# EasyEDA schematic SCH_Snoopy_2026-08-06.json

## Sheets
1 Ethernet_IO: TITLE: Ethernet IO; REV: 1.0; Date: 2026-07-02; Sheet: 1/1; Drawn By: httperry; Company: HackClub - Macondo
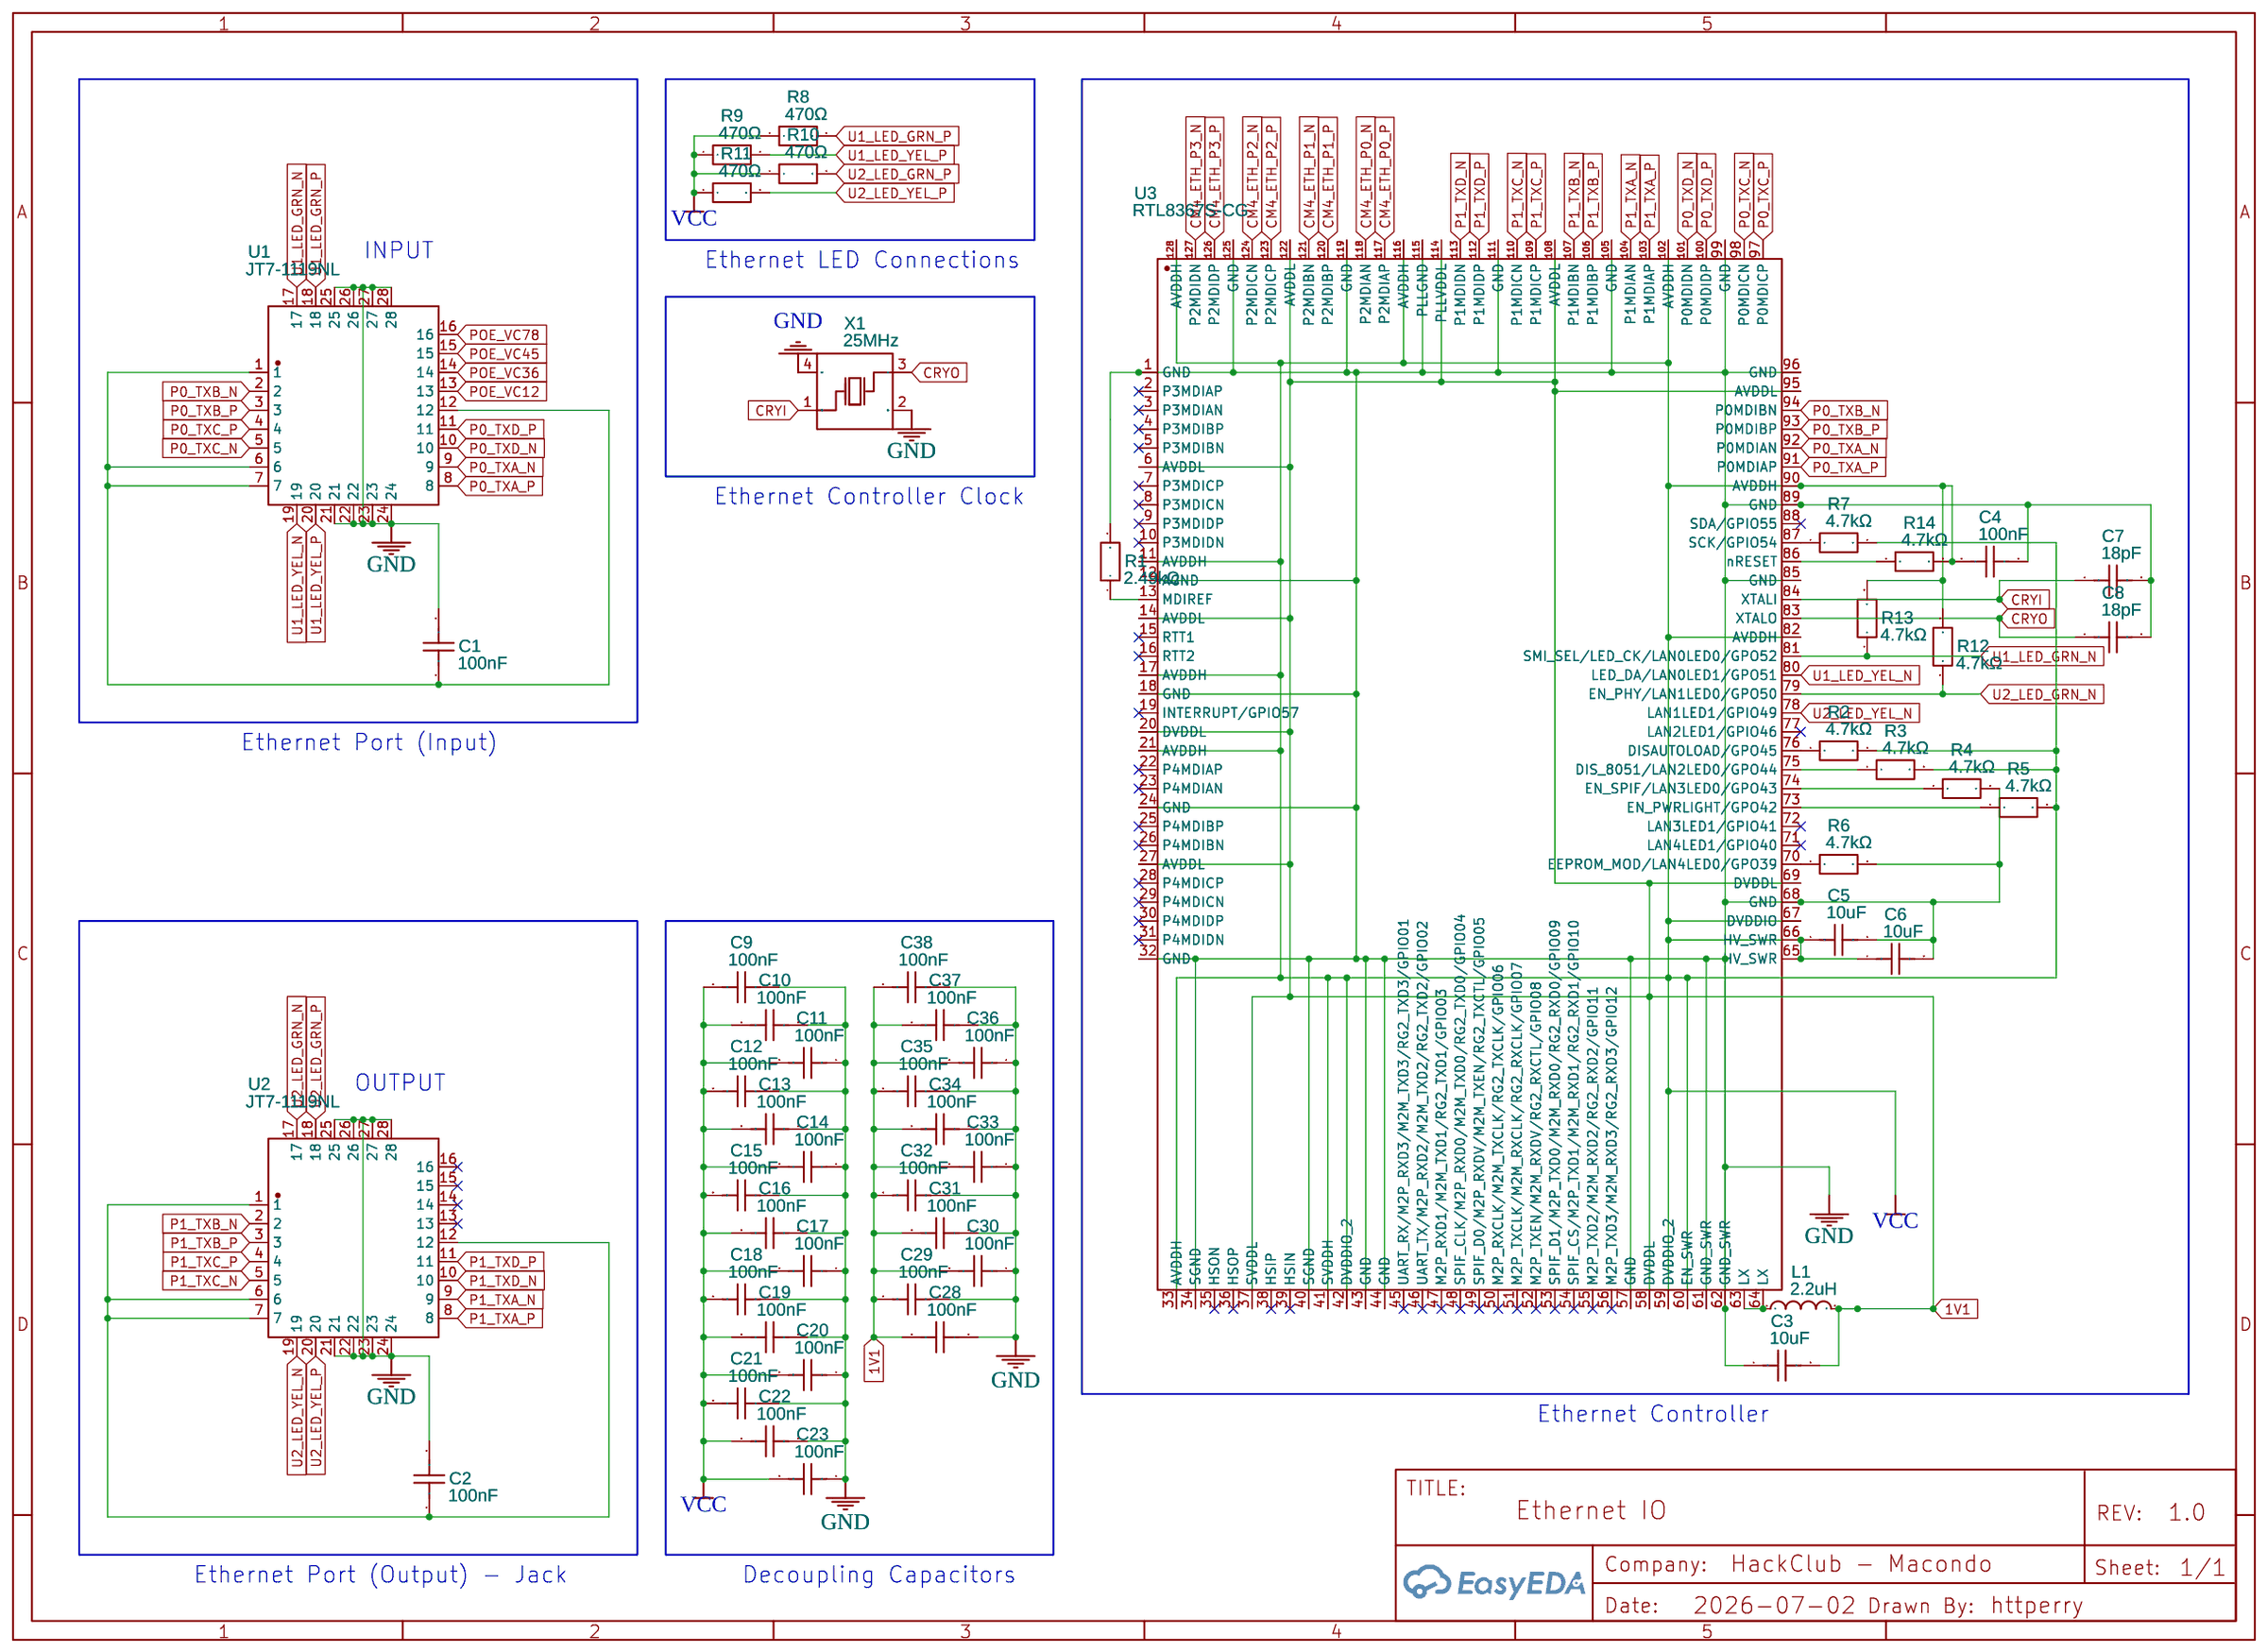
[diagram p0: Ethernet_IO]
2 PWR_Management: TITLE: PWR_Management; Date: 2026-07-03
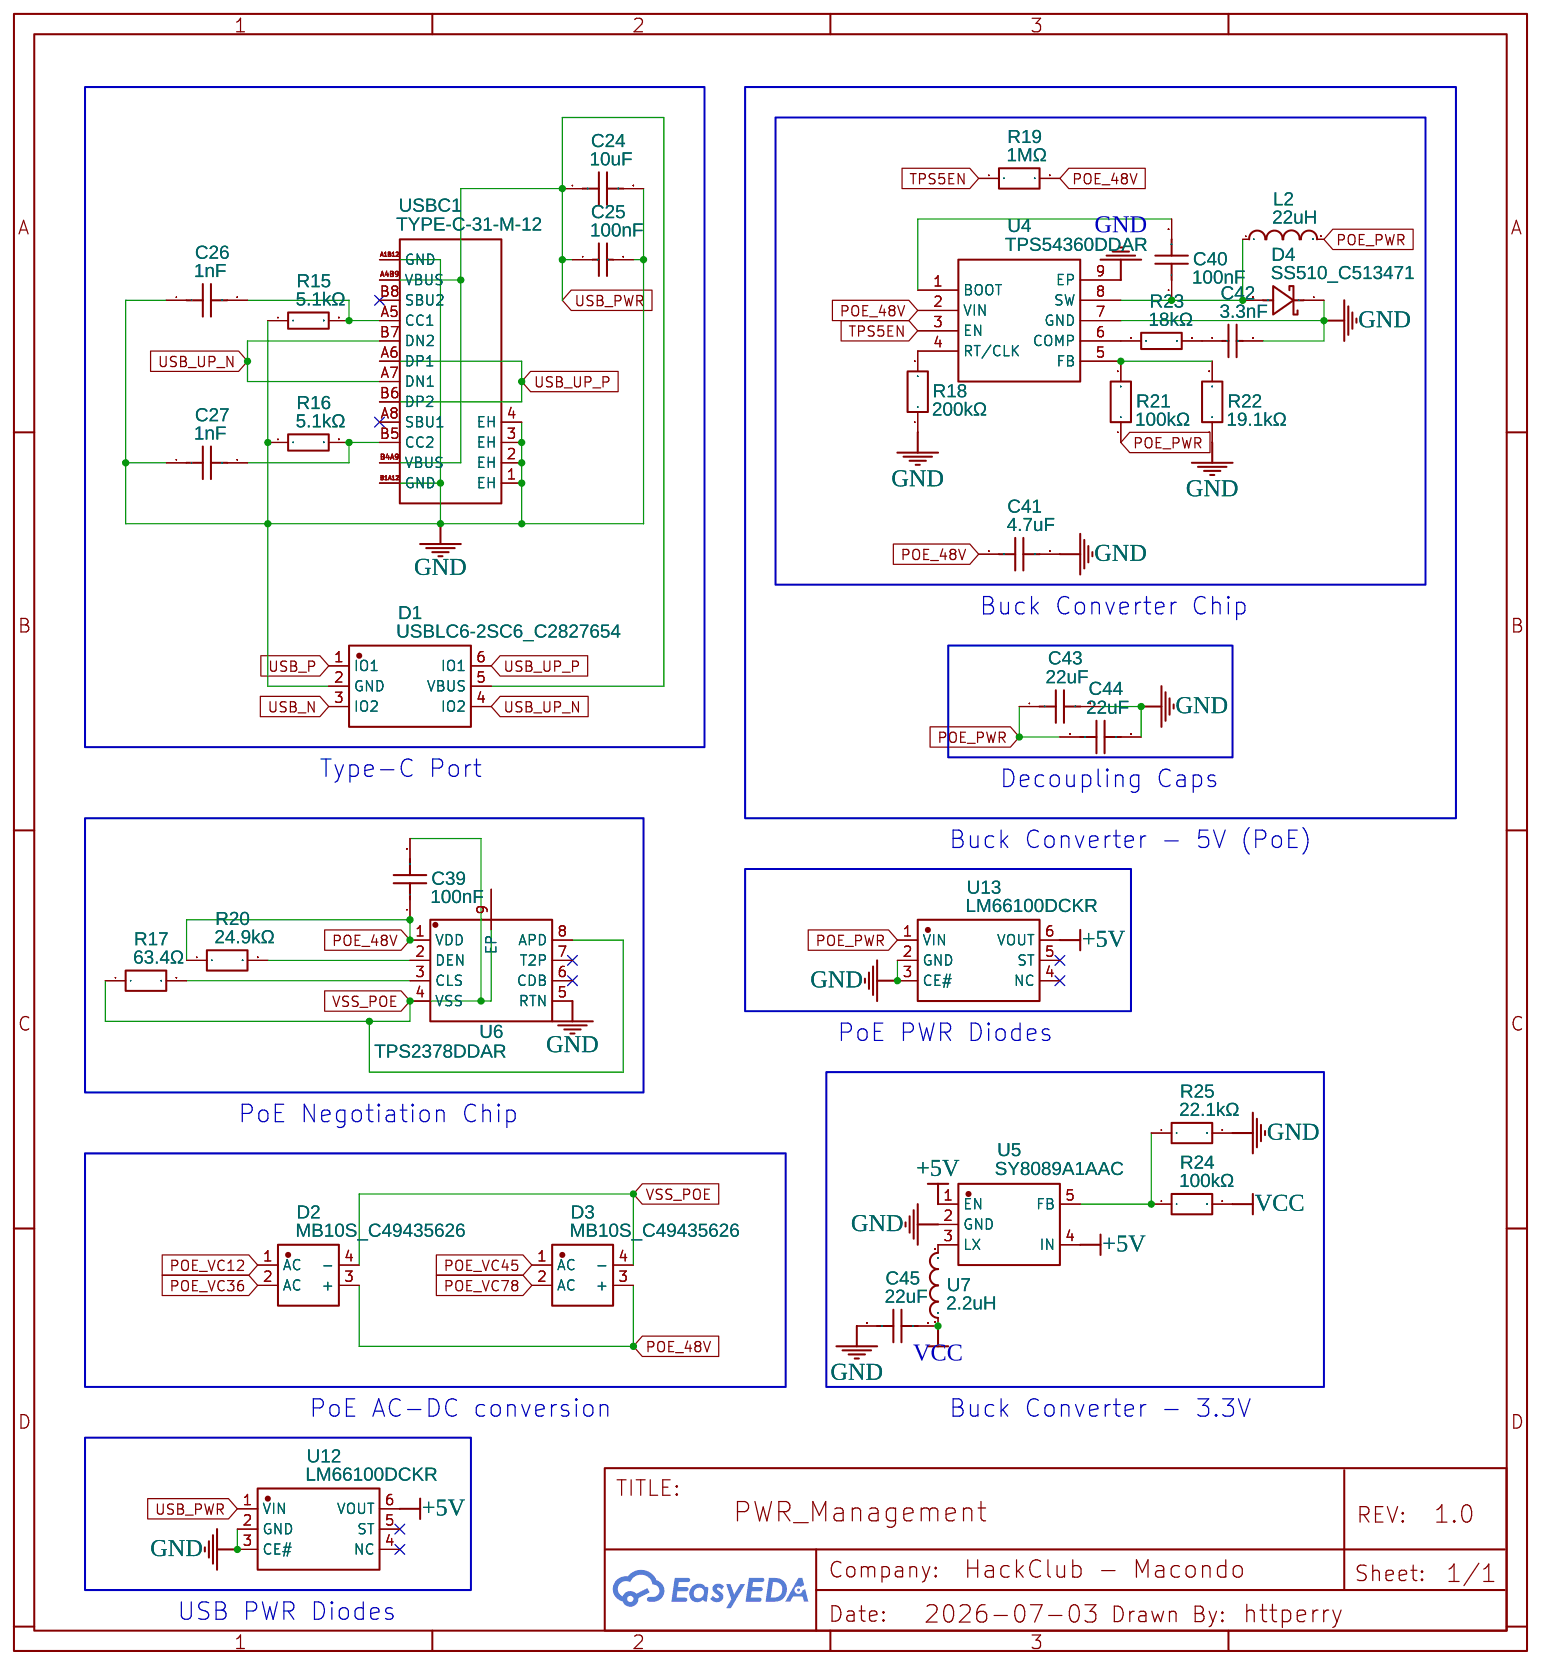
[diagram p1: PWR_Management]
3 RPCM4_Connector: TITLE: RPCM4_Connector; Date: 2026-07-03
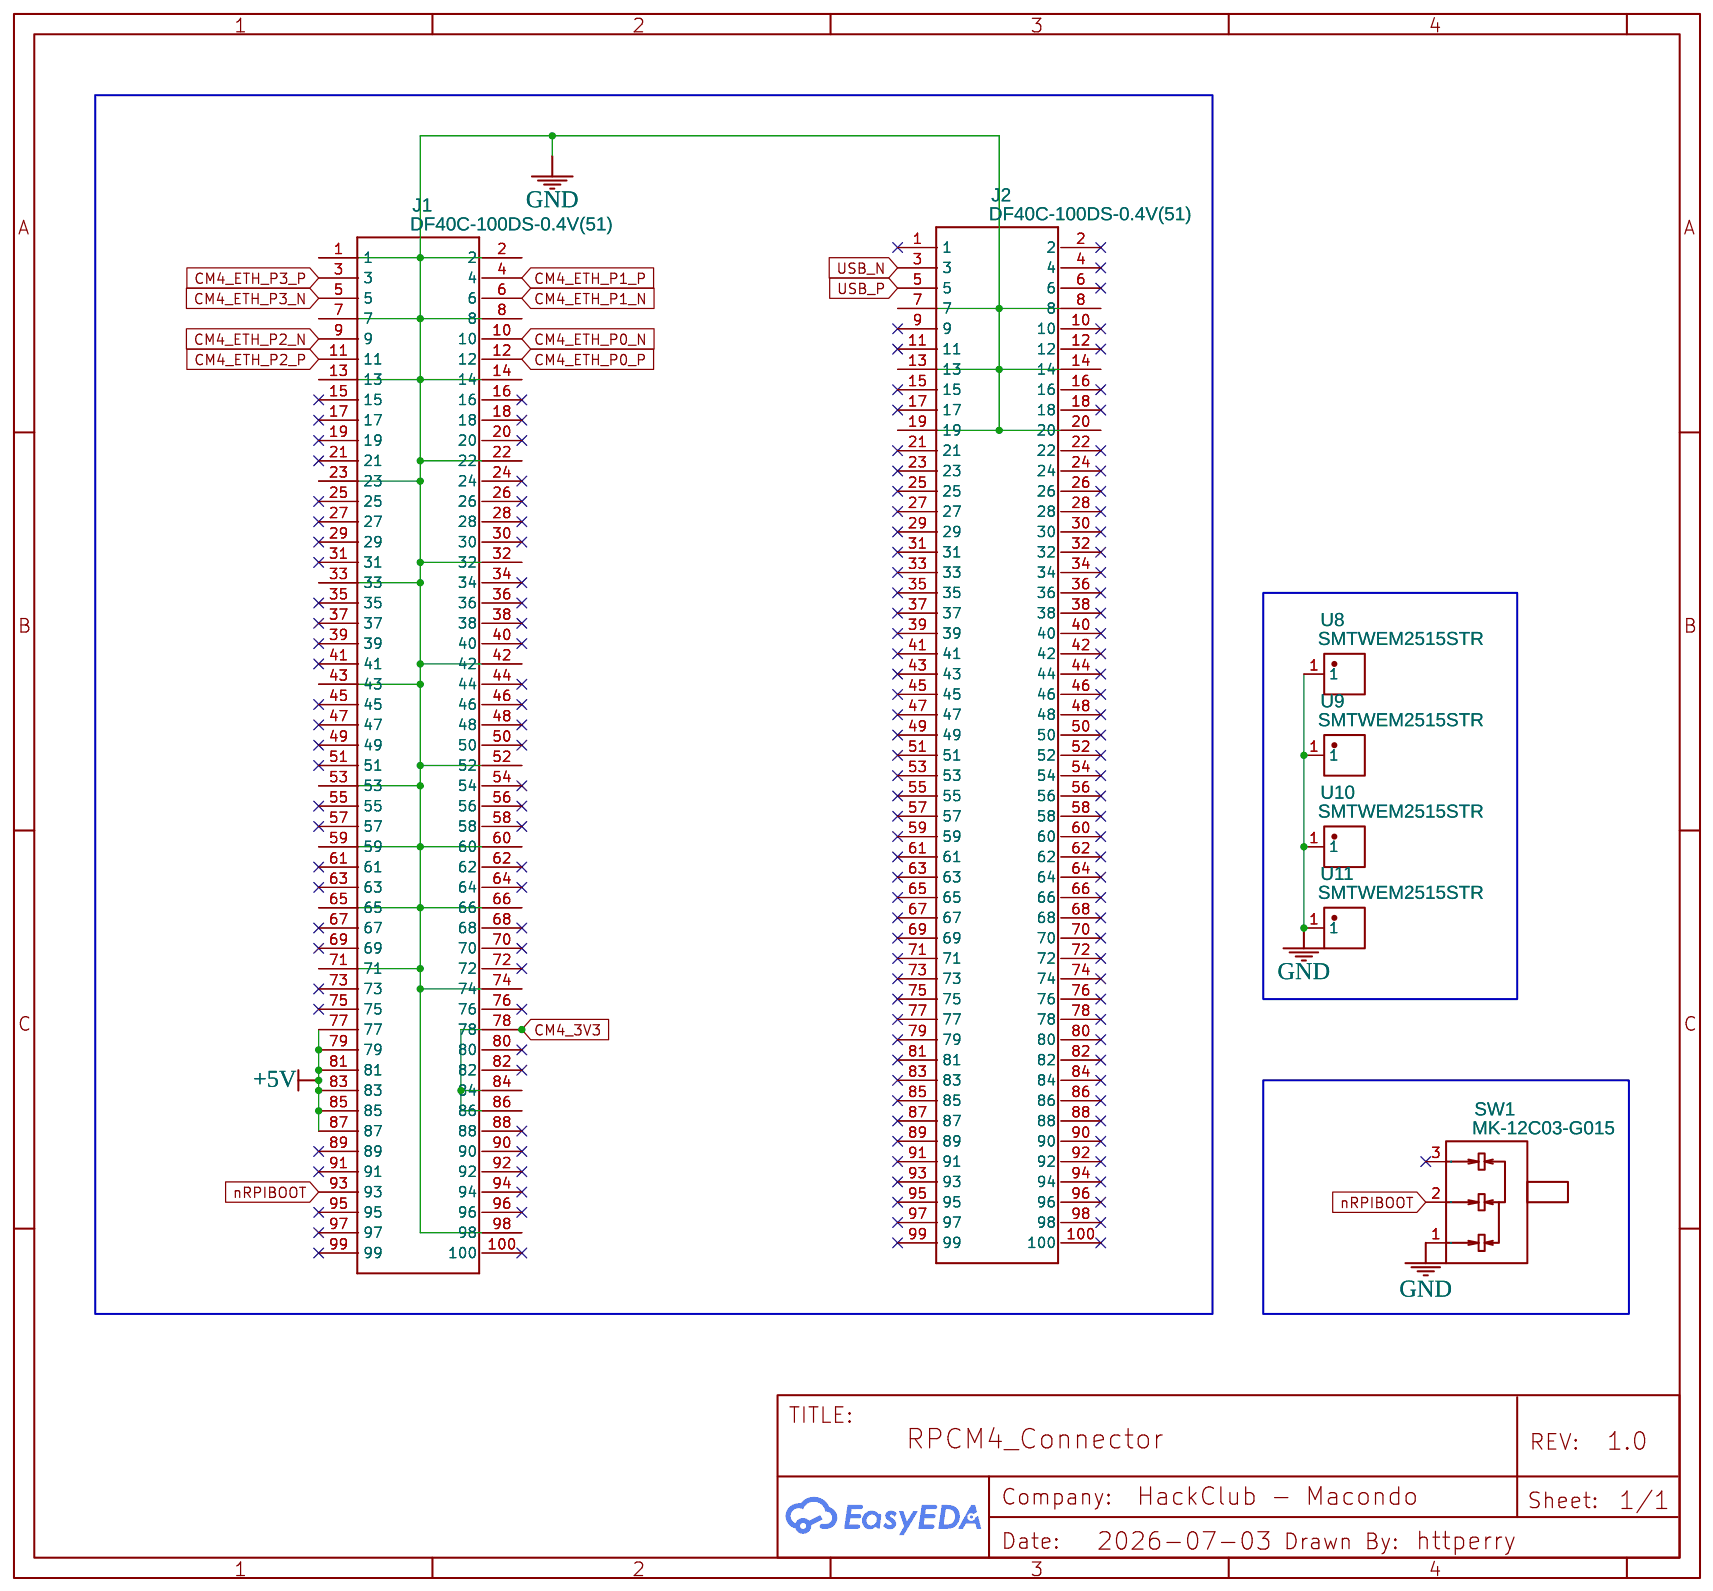
[diagram p2: RPCM4_Connector]

## Parts
sheet Ethernet_IO
C1  100nF  [C0402]
C2  100nF  [C0402]
C3  10uF  [C0603]
C4  100nF  [C0402]
C5  10uF  [C0603]
C6  10uF  [C0603]
C7  18pF  [C0402]
C8  18pF  [C0402]
C9  100nF  [C0402]
C10  100nF  [C0402]
C11  100nF  [C0402]
C12  100nF  [C0402]
C13  100nF  [C0402]
C14  100nF  [C0402]
C15  100nF  [C0402]
C16  100nF  [C0402]
C17  100nF  [C0402]
C18  100nF  [C0402]
C19  100nF  [C0402]
C20  100nF  [C0402]
C21  100nF  [C0402]
C22  100nF  [C0402]
C23  100nF  [C0402]
C28  100nF  [C0402]
C29  100nF  [C0402]
C30  100nF  [C0402]
C31  100nF  [C0402]
C32  100nF  [C0402]
C33  100nF  [C0402]
C34  100nF  [C0402]
C35  100nF  [C0402]
C36  100nF  [C0402]
C37  100nF  [C0402]
C38  100nF  [C0402]
L1  2.2uH  [IND-SMD_L1.6-W0.8_FTC160865S2R2MBCA]
R1  2.49kΩ  [R0402]
R2  4.7kΩ  [R0402]
R3  4.7kΩ  [R0402]
R4  4.7kΩ  [R0402]
R5  4.7kΩ  [R0402]
R6  4.7kΩ  [R0402]
R7  4.7kΩ  [R0402]
R8  470Ω  [R0402]
R9  470Ω  [R0402]
R10  470Ω  [R0402]
R11  470Ω  [R0402]
R12  4.7kΩ  [R0402]
R13  4.7kΩ  [R0402]
R14  4.7kΩ  [R0402]
U1  JT7-1119NL  [CONN-TH_JT7-1119NL]
U2  JT7-1119NL  [CONN-TH_JT7-1119NL]
U3  RTL8367S-CG  [LQFP-128_L14.0-W14.0-P0.40-LS16.0-BL]
X1  25MHz  [CRYSTAL-SMD_4P-L3.2-W2.5-BL-1]
sheet PWR_Management
C24  10uF  [C0603]
C25  100nF  [C0402]
C26  1nF  [C0402]
C27  1nF  [C0402]
C39  100nF  [C0603]
C40  100nF  [C0603]
C41  4.7uF  [C1206]
C42  3.3nF  [C0402]
C43  22uF  [C0603]
C44  22uF  [C0603]
C45  22uF  [C0402]
D1  USBLC6-2SC6_C2827654  [SOT-23-6_L2.9-W1.6-P0.95-LS2.8-BL]
D2  MB10S_C49435626  [MBS_L4.7-W4.0-P2.50-LS7.0-TL]
D3  MB10S_C49435626  [MBS_L4.7-W4.0-P2.50-LS7.0-TL]
D4  SS510_C513471  [SMA_L4.3-W2.6-LS5.0-RD]
L2  22uH  [IND-SMD_L7.1-W6.6]
R15  5.1kΩ  [R0603]
R16  5.1kΩ  [R0603]
R17  63.4Ω  [R0603]
R18  200kΩ  [R0402]
R19  1MΩ  [R0805]
R20  24.9kΩ  [R0603]
R21  100kΩ  [R0402]
R22  19.1kΩ  [R0402]
R23  18kΩ  [R0402]
R24  100kΩ  [R0402]
R25  22.1kΩ  [R0402]
U4  TPS54360DDAR  [SOIC-8_L5.0-W4.0-P1.27-LS6.0-BL-EP2.0]
U5  SY8089A1AAC  [TSOT-23-5_L2.9-W1.6-P0.95-LS2.8-BR]
U6  TPS2378DDAR  [SO-8_L4.9-W3.9-P1.27-LS6.0-BL-EP]
U7  2.2uH  [IND-SMD_L2.0-W1.6-B]
U12  LM66100DCKR  [SC-70-6_L2.0-W1.3-P0.65-LS2.1-BL]
U13  LM66100DCKR  [SC-70-6_L2.0-W1.3-P0.65-LS2.1-BL]
USBC1  TYPE-C-31-M-12  [USB-C_SMD-TYPE-C-31-M-12_1]
sheet RPCM4_Connector
J1  DF40C-100DS-0.4V(51)  [HRS_DF40C-100DS-0.4V(51)]
J2  DF40C-100DS-0.4V(51)  [HRS_DF40C-100DS-0.4V(51)]
SW1  MK-12C03-G015  [SW-SMD_MK-12C03-G015]
U8  SMTWEM2515STR  [SMD_BD5.0-D3.5]
U9  SMTWEM2515STR  [SMD_BD5.0-D3.5]
U10  SMTWEM2515STR  [SMD_BD5.0-D3.5]
U11  SMTWEM2515STR  [SMD_BD5.0-D3.5]

## Library data of the parts
C1 C2 C4 C9-C23 C28-C38 = AC0402KRX7R9BB104: Contributor: LCSC; Supplier: LCSC; Supplier Part: C2888326; Manufacturer: YAGEO(国巨); JLCPCB Part Class: Extended Part
C3 C5 C6 C24 = HGC0603R5106M250NTHJ: Supplier: LCSC; Supplier Part: C7472961; Manufacturer: Chinocera(华瓷); Contributor: lcsc; JLCPCB Part Class: Extended Part
C7 C8 = GRM1555C1H180JA01D: Supplier: LCSC; Manufacturer: muRata(村田); Supplier Part: C33149; JLCPCB Part Class: Extended Part
L1 = ZEMS160865-2R2M: Supplier: LCSC; Supplier Part: C48945029; Manufacturer: ZE(增益); JLCPCB Part Class: Extended Part; Contributor: lcsc
R1 = FRC0402F2491TS: Supplier: LCSC; Supplier Part: C2933083; Manufacturer: FOJAN(富捷); Contributor: lcsc; JLCPCB Part Class: Extended Part
R2-R7 R12-R14 = CRCW04024K70FKED: Contributor: LCSC; Supplier: LCSC; Supplier Part: C482193; Manufacturer: VISHAY(威世); JLCPCB Part Class: Extended Part
R8-R11 = FRC0402F4700TS: Supplier: LCSC; Supplier Part: C2909361; Manufacturer: FOJAN(富捷); JLCPCB Part Class: Extended Part; Contributor: lcsc
U1 U2 = JT7-1119NL: Supplier: LCSC; Supplier Part: C3178801; Manufacturer: PULSE(普思); JLCPCB Part Class: Extended Part; Contributor: lcsc
U3 = RTL8367S-CG: Contributor: LCSC; Supplier: LCSC; Supplier Part: C2760849; Manufacturer: REALTEK(瑞昱); JLCPCB Part Class: Extended Part
X1 = SMD-3225_4P25MHZ20PF10PPM-40&#126;+85℃: Contributor: LCSC; Supplier: LCSC; Supplier Part: C164045; Manufacturer: YJX(雅晶鑫); Manufacturer Part: TAXM25M4RLBCCT2T; JLCPCB Part Class: Extended Part
C25 = CC0402KRX5R8BB104: Supplier: LCSC; Manufacturer: YAGEO(国巨); Supplier Part: C106256; JLCPCB Part Class: Extended Part
C26 C27 = CC0402KRX7R8BB102: Contributor: LCSC; Supplier: LCSC; Supplier Part: C541372; Manufacturer: YAGEO(国巨); JLCPCB Part Class: Extended Part
C39 C40 = GCJ188R72A104KA01D: Contributor: LCSC; Supplier: LCSC; Supplier Part: C161117; Manufacturer: muRata(村田); JLCPCB Part Class: Extended Part
C41 = GRM31CC72A475KE11L: Contributor: LCSC; Supplier: LCSC; Supplier Part: C237304; Manufacturer: muRata(村田); JLCPCB Part Class: Extended Part
C42 = CC0402KRX7R9BB332: Supplier: LCSC; Manufacturer: YAGEO(国巨); Supplier Part: C107028; JLCPCB Part Class: Extended Part
C43 C44 = CL10A226MP8NUNE: Supplier: LCSC; Manufacturer: SAMSUNG(三星); Supplier Part: C86295; JLCPCB Part Class: Extended Part; link: https://lcsc.com/eda_search?q=C86295&%26type=1&ref=editor
C45 = HGC0402R5226M100NTEJ: Supplier: LCSC; Supplier Part: C22367823; Manufacturer: Chinocera(华瓷); JLCPCB Part Class: Extended Part; Contributor: lcsc
D1 = USBLC6-2SC6_C2827654: Contributor: LCSC; Supplier: LCSC; Supplier Part: C2827654; Manufacturer: TECH PUBLIC(台舟); Manufacturer Part: USBLC6-2SC6; JLCPCB Part Class: Extended Part
D2 D3 = MB10S_C49435626: Supplier: LCSC; Supplier Part: C49435626; Manufacturer: Huixin(慧芯); Manufacturer Part: MB10S; JLCPCB Part Class: Extended Part; Contributor: lcsc
D4 = SS510_C513471: Contributor: LCSC; Supplier: LCSC; Supplier Part: C513471; Manufacturer: Slkor(萨科微); Manufacturer Part: SS510; JLCPCB Part Class: Extended Part; link: https://lcsc.com/eda_search?q=C513471&%26type=1&ref=editor
L2 = YSPI0630A-220M: Contributor: LCSC; Supplier: LCSC; Supplier Part: C497873; Manufacturer: YJYCOIN(益嘉源); JLCPCB Part Class: Extended Part
R15 R16 = RMC06035.1K5%N: Contributor: LCSC; Supplier: LCSC; Supplier Part: C269696; Manufacturer: Tyohm(幸亚电阻); JLCPCB Part Class: Extended Part
R17 = PTFR0603B63R4P9: Supplier: LCSC; Supplier Part: C47115900; Manufacturer: RESI(开步睿思); JLCPCB Part Class: Extended Part; Contributor: lcsc
R18 = ARG02BTC2003: Supplier: LCSC; Supplier Part: C2984414; Manufacturer: Viking(光颉); JLCPCB Part Class: Extended Part; Contributor: lcsc
R19 = AR05BTC1004: Contributor: LCSC; Supplier: LCSC; Supplier Part: C374666; Manufacturer: Viking(光颉); JLCPCB Part Class: Extended Part
R20 = PTFR0603B24K9N9: Contributor: LCSC; Supplier: LCSC; Supplier Part: C2692729; Manufacturer: RESI(开步睿思); JLCPCB Part Class: Extended Part
R21 R24 = RT0402BRD07100KL: Supplier: LCSC; Supplier Part: C852472; Manufacturer: YAGEO(国巨); JLCPCB Part Class: Extended Part; Contributor: lcsc
R22 = FRC0402F1912TS: Supplier: LCSC; Supplier Part: C2998158; Manufacturer: FOJAN(富捷); JLCPCB Part Class: Extended Part; Contributor: lcsc
R23 = AECR0402F18K0K9: Contributor: LCSC; Supplier: LCSC; Supplier Part: C352468; Manufacturer: RESI(开步睿思); JLCPCB Part Class: Extended Part
R25 = CRCW040222K1FKED: Supplier: LCSC; Supplier Part: C844504; Manufacturer: VISHAY(威世); JLCPCB Part Class: Extended Part; Contributor: lcsc
U4 = TPS54360DDAR: Supplier: LCSC; Manufacturer: TI(德州仪器); Supplier Part: C44377; JLCPCB Part Class: Extended Part
U5 = SY8089A1AAC: Contributor: LCSC; Supplier: LCSC; Supplier Part: C479074; Manufacturer: Silergy(矽力杰); JLCPCB Part Class: Extended Part
U6 = TPS2378DDAR: Contributor: LCSC; Supplier: LCSC; Supplier Part: C337500; Manufacturer: TI(德州仪器); JLCPCB Part Class: Extended Part; link: https://lcsc.com/eda_search?q=C337500&%26type=1&ref=editor
U7 = FTC201610S2R2MBCA: Supplier: LCSC; Supplier Part: C5832344; Manufacturer: cjiang(长江微电); JLCPCB Part Class: Extended Part; Contributor: lcsc
U12 U13 = LM66100DCKR: Contributor: LCSC; Supplier: LCSC; Supplier Part: C2869734; Manufacturer: TI(德州仪器); JLCPCB Part Class: Extended Part
USBC1 = TYPE-C-31-M-12: Contributor: LCSC; Supplier: LCSC; Supplier Part: C165948; Manufacturer: 韩国韩荣; JLCPCB Part Class: Extended Part
J1 = DF40C-100DS-0.4V(51): Contributor: Dieter Hamer; Supplier Part: C597931; Manufacturer: HRS(广濑)
J2 = DF40C-100DS-0.4V(51): Contributor: Dieter Hamer; Manufacturer: HRS(广濑); Supplier Part: C597931
SW1 = MK-12C03-G015: Contributor: lcsc; Supplier: LCSC; Supplier Part: C2890358; Manufacturer: G-Switch(品赞); JLCPCB Part Class: Extended Part
U8-U11 = SMTWEM2515STR: Supplier: LCSC; Supplier Part: C5301785; Manufacturer: YIYUAN(怡远); Contributor: lcsc; JLCPCB Part Class: Extended Part

## Nets
1V1: C3.2 C28.2 C29.2 C30.2 C31.2 C32.2 C33.2 C34.2 C35.2 C36.2 C37.2 C38.2 L1.2 U3.6(AVDDL) U3.14(AVDDL) U3.20(DVDDL) U3.27(AVDDL) U3.37(SVDDL) U3.58(DVDDL) U3.69(DVDDL) U3.95(AVDDL) U3.108(AVDDL) U3.114(PLLVDDL) U3.122(AVDDL)
+5V: J1.77 J1.79 J1.81 J1.83 J1.85 J1.87 U5.1(EN) U5.4(IN) U12.6(VOUT) U13.6(VOUT)
GND: C1.2 C2.2 C3.1 C4.1 C5.2 C6.2 C7.2 C8.2 C9.1 C10.1 C11.1 C12.1 C13.1 C14.1 C15.1 C16.1 C17.1 C18.1 C19.1 C20.1 C21.1 C22.1 C23.1 C24.2 C25.2 C26.1 C27.1 C28.1 C29.1 C30.1 C31.1 C32.1 C33.1 C34.1 C35.1 C36.1 C37.1 C38.1 C41.2 C42.2 C43.2 C44.2 C45.1 D1.2(GND) D4.1(K) J1.1 J1.2 J1.7 J1.8 J1.13 J1.14 J1.22 J1.23 J1.32 J1.33 J1.42 J1.43 J1.52 J1.53 J1.59 J1.60 J1.65 J1.66 J1.71 J1.74 J1.98 J2.7 J2.8 J2.13 J2.14 J2.19 J2.20 R1.2 R4.2 R6.2 R15.1 R16.1 R18.1 R22.1 R25.2 SW1.1 U1.21 U1.22 U1.23 U1.24 U1.25 U1.26 U1.27 U1.28 U2.21 U2.22 U2.23 U2.24 U2.25 U2.26 U2.27 U2.28 U3.1(GND) U3.12(AGND) U3.18(GND) U3.24(GND) U3.32(GND) U3.34(SGND) U3.40(SGND) U3.43(GND) U3.44(GND) U3.57(GND) U3.61(GND_SWR) U3.62(GND_SWR) U3.68(GND) U3.85(GND) U3.89(GND) U3.96(GND) U3.99(GND) U3.105(GND) U3.111(GND) U3.115(PLLGND) U3.119(GND) U3.125(GND) U4.7(GND) U4.9(EP) U5.2(GND) U6.5(RTN) U8.1 U9.1 U10.1 U11.1 U12.2(GND) U12.3(CE#) U13.2(GND) U13.3(CE#) USBC1.1(EH) USBC1.2(EH) USBC1.3(EH) USBC1.4(EH) USBC1.A1B12(GND) USBC1.B1A12(GND) X1.2(GND) X1.4(GND)
VCC: C4.2 C5.1 C6.1 C9.2 C10.2 C11.2 C12.2 C13.2 C14.2 C15.2 C16.2 C17.2 C18.2 C19.2 C20.2 C21.2 C22.2 C23.2 C45.2 R2.2 R3.2 R5.2 R7.2 R8.1 R9.1 R10.1 R11.1 R12.2 R13.2 R14.2 R24.2 U3.11(AVDDH) U3.17(AVDDH) U3.21(AVDDH) U3.33(AVDDH) U3.41(SVDDH) U3.42(DVDDIO_2) U3.59(DVDDIO_2) U3.60(EN_SWR) U3.65(HV_SWR) U3.66(HV_SWR) U3.67(DVDDIO) U3.82(AVDDH) U3.90(AVDDH) U3.102(AVDDH) U3.116(AVDDH) U3.128(AVDDH) U7.1
VSS_POE: C39.2 D2.4(-) D3.4(-) R17.1 U6.4(VSS) U6.8(APD) U6.9(EP)
CM4_3V3: J1.78 J1.84 J1.86
CM4_ETH_P0_N: J1.10 U3.118(P2MDIAN)
CM4_ETH_P0_P: J1.12 U3.117(P2MDIAP)
CM4_ETH_P1_N: J1.6 U3.121(P2MDIBN)
CM4_ETH_P1_P: J1.4 U3.120(P2MDIBP)
CM4_ETH_P2_N: J1.9 U3.124(P2MDICN)
CM4_ETH_P2_P: J1.11 U3.123(P2MDICP)
CM4_ETH_P3_N: J1.5 U3.127(P2MDIDN)
CM4_ETH_P3_P: J1.3 U3.126(P2MDIDP)
CRYI: C7.1 U3.84(XTALI) X1.1(OSC1)
CRYO: C8.1 U3.83(XTALO) X1.3(OSC2)
nRPIBOOT: J1.93 SW1.2
P0_TXA_N: U1.9 U3.92(P0MDIAN)
P0_TXA_P: U1.8 U3.91(P0MDIAP)
P0_TXB_N: U1.2 U3.94(P0MDIBN)
P0_TXB_P: U1.3 U3.93(P0MDIBP)
P0_TXC_N: U1.5 U3.98(P0MDICN)
P0_TXC_P: U1.4 U3.97(P0MDICP)
P0_TXD_N: U1.10 U3.101(P0MDIDN)
P0_TXD_P: U1.11 U3.100(P0MDIDP)
P1_TXA_N: U2.9 U3.104(P1MDIAN)
P1_TXA_P: U2.8 U3.103(P1MDIAP)
P1_TXB_N: U2.2 U3.107(P1MDIBN)
P1_TXB_P: U2.3 U3.106(P1MDIBP)
P1_TXC_N: U2.5 U3.110(P1MDICN)
P1_TXC_P: U2.4 U3.109(P1MDICP)
P1_TXD_N: U2.10 U3.113(P1MDIDN)
P1_TXD_P: U2.11 U3.112(P1MDIDP)
POE_48V: C39.1 C41.1 D2.3(+) D3.3(+) R19.2 R20.1 U4.2(VIN) U6.1(VDD)
POE_PWR: C43.1 C44.1 L2.2 R21.1 U13.1(VIN)
POE_VC12: D2.1(AC) U1.13
POE_VC36: D2.2(AC) U1.14
POE_VC45: D3.1(AC) U1.15
POE_VC78: D3.2(AC) U1.16
TPS5EN: R19.1 U4.3(EN)
U1_LED_GRN_N: R13.1 U1.17 U3.81(SMI_SEL/LED_CK/LAN0LED0/GPO52)
U1_LED_GRN_P: R8.2 U1.18
U1_LED_YEL_N: U1.19 U3.80(LED_DA/LAN0LED1/GPO51)
U1_LED_YEL_P: R9.2 U1.20
U2_LED_GRN_N: R12.1 U2.17 U3.79(EN_PHY/LAN1LED0/GPO50)
U2_LED_GRN_P: R10.2 U2.18
U2_LED_YEL_N: U2.19 U3.78(LAN1LED1/GPIO49)
U2_LED_YEL_P: R11.2 U2.20
USB_N: D1.3(IO2) J2.3
USB_P: D1.1(IO1) J2.5
USB_PWR: C24.1 C25.1 D1.5(VBUS) U12.1(VIN) USBC1.A4B9(VBUS) USBC1.B4A9(VBUS)
USB_UP_N: D1.4(IO2) USBC1.A7(DN1) USBC1.B7(DN2)
USB_UP_P: D1.6(IO1) USBC1.A6(DP1) USBC1.B6(DP2)
Net-(C1-1): C1.1 U1.1 U1.6 U1.7 U1.12
Net-(C2-1): C2.1 U2.1 U2.6 U2.7 U2.12
Net-(C26-2): C26.2 R15.2 USBC1.A5(CC1)
Net-(C27-2): C27.2 R16.2 USBC1.B5(CC2)
Net-(C40-1): C40.1 D4.2(A) L2.1 U4.8(SW)
Net-(C40-2): C40.2 U4.1(BOOT)
Net-(C42-1): C42.1 R23.2
Net-(L1-1): L1.1 U3.63(LX) U3.64(LX)
Net-(R1-1): R1.1 U3.13(MDIREF)
Net-(R2-1): R2.1 U3.76(DISAUTOLOAD/GPO45)
Net-(R3-1): R3.1 U3.75(DIS_8051/LAN2LED0/GPO44)
Net-(R4-1): R4.1 U3.74(EN_SPIF/LAN3LED0/GPO43)
Net-(R5-1): R5.1 U3.73(EN_PWRLIGHT/GPO42)
Net-(R6-1): R6.1 U3.70(EEPROM_MOD/LAN4LED0/GPO39)
Net-(R7-1): R7.1 U3.87(SCK/GPIO54)
Net-(R14-1): R14.1 U3.86(nRESET)
Net-(R17-2): R17.2 U6.3(CLS)
Net-(R18-2): R18.2 U4.4(RT/CLK)
Net-(R20-2): R20.2 U6.2(DEN)
Net-(R21-2): R21.2 R22.2 U4.5(FB)
Net-(R23-1): R23.1 U4.6(COMP)
Net-(R24-1): R24.1 R25.1 U5.5(FB)
Net-(U5-3): U5.3(LX) U7.2

Not connected (* = marked no-connect by the designer): J1 15* 16* 17* 18* 19* 20* 21* 24* 25* 26* 27* 28* 29* 30* 31* 34* 35* 36* 37* 38* 39* 40* 41* 44* 45* 46* 47* 48* 49* 50* 51* 54* 55* 56* 57* 58* 61* 62* 63* 64* 67* 68* 69* 70* 72* 73* 75* 76* 80* 82* 88* 89* 90* 91* 92* 94* 95* 96* 97* 99* 100*; J2 1* 2* 4* 6* 9* 10* 11* 12* 15* 16* 17* 18* 21* 22* 23* 24* 25* 26* 27* 28* 29* 30* 31* 32* 33* 34* 35* 36* 37* 38* 39* 40* 41* 42* 43* 44* 45* 46* 47* 48* 49* 50* 51* 52* 53* 54* 55* 56* 57* 58* 59* 60* 61* 62* 63* 64* 65* 66* 67* 68* 69* 70* 71* 72* 73* 74* 75* 76* 77* 78* 79* 80* 81* 82* 83* 84* 85* 86* 87* 88* 89* 90* 91* 92* 93* 94* 95* 96* 97* 98* 99* 100*; SW1 3*; U2 13* 14* 15* 16*; U3 2(P3MDIAP)* 3(P3MDIAN)* 4(P3MDIBP)* 5(P3MDIBN)* 7(P3MDICP)* 8(P3MDICN)* 9(P3MDIDP)* 10(P3MDIDN)* 15(RTT1)* 16(RTT2)* 19(INTERRUPT/GPIO57)* 22(P4MDIAP)* 23(P4MDIAN)* 25(P4MDIBP)* 26(P4MDIBN)* 28(P4MDICP)* 29(P4MDICN)* 30(P4MDIDP)* 31(P4MDIDN)* 35(HSON)* 36(HSOP)* 38(HSIP)* 39(HSIN)* 45(UART_RX/M2P_RXD3/M2M_TXD3/RG2_TXD3/GPIO01)* 46(UART_TX/M2P_RXD2/M2M_TXD2/RG2_TXD2/GPIO02)* 47(M2P_RXD1/M2M_TXD1/RG2_TXD1/GPIO03)* 48(SPIF_CLK/M2P_RXD0/M2M_TXD0/RG2_TXD0/GPIO04)* 49(SPIF_D0/M2P_RXDV/M2M_TXEN/RG2_TXCTL/GPIO05)* 50(M2P_RXCLK/M2M_TXCLK/RG2_TXCLK/GPIO06)* 51(M2P_TXCLK/M2M_RXCLK/RG2_RXCLK/GPIO07)* 52(M2P_TXEN/M2M_RXDV/RG2_RXCTL/GPIO08)* 53(SPIF_D1/M2P_TXD0/M2M_RXD0/RG2_RXD0/GPIO09)* 54(SPIF_CS/M2P_TXD1/M2M_RXD1/RG2_RXD1/GPIO10)* 55(M2P_TXD2/M2M_RXD2/RG2_RXD2/GPIO11)* 56(M2P_TXD3/M2M_RXD3/RG2_RXD3/GPIO12)* 71(LAN4LED1/GPIO40)* 72(LAN3LED1/GPIO41)* 77(LAN2LED1/GPIO46)* 88(SDA/GPIO55)*; U6 6(CDB)* 7(T2P)*; U12 4(NC)* 5(ST)*; U13 4(NC)* 5(ST)*; USBC1 A8(SBU1)* B8(SBU2)*

## Notes on the sheets
sheet 1
- INPUT
- Ethernet LED Connections
- Ethernet Controller Clock
- Ethernet Port (Input)
- OUTPUT
- Ethernet Controller
- Ethernet Port (Output) - Jack
- Decoupling Capacitors
sheet 2
- Buck Converter Chip
- Type-C Port
- Decoupling Caps
- Buck Converter - 5V (PoE)
- PoE PWR Diodes
- PoE Negotiation Chip
- PoE AC-DC conversion
- Buck Converter - 3.3V
- USB PWR Diodes
